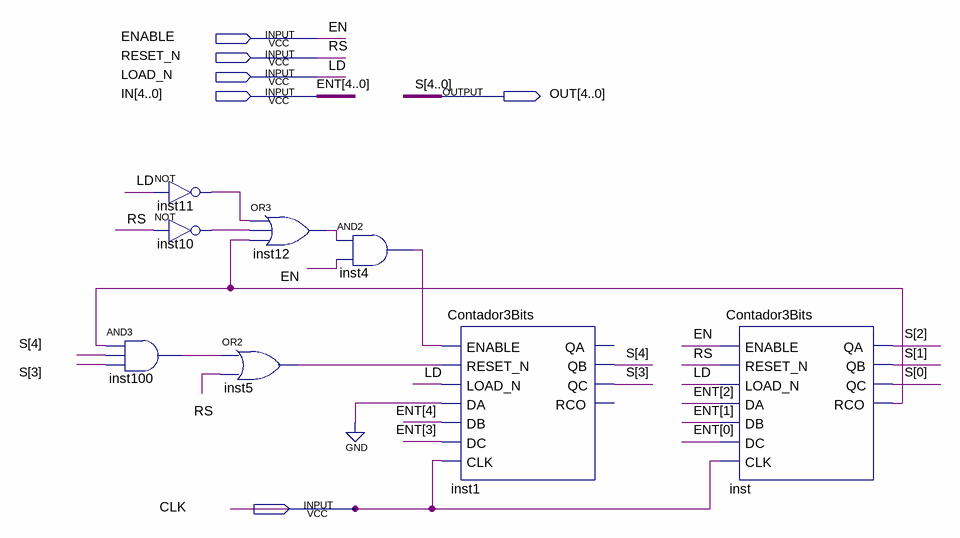
[diagram p0: schematic sheet]
// Quartus schematic PC.bdf as structural Verilog: 8 symbols, 6 pins
module PC (
  input  ENABLE,
  input  RESET_N,
  input  LOAD_N,
  input  [4:0] IN,
  input  CLK,
  output [4:0] OUT
);

  wire inst4_out, inst5_out, inst10_out, inst11_out, inst12_out, inst100_out, inst_rco;

  and inst100 (inst100_out, inst_rco, OUT[4], OUT[3]);
  not inst11 (inst11_out, LOAD_N);
  not inst10 (inst10_out, RESET_N);
  or inst12 (inst12_out, inst11_out, inst10_out, inst_rco);
  or inst5 (inst5_out, inst100_out, RESET_N);
  and inst4 (inst4_out, inst12_out, ENABLE);
  Contador3Bits inst1 (
    .ENABLE(inst4_out), .RESET_N(inst5_out), .LOAD_N(LOAD_N), .DA(1'b0), .DB(IN[4]), .DC(IN[3]), .CLK(CLK),
    .QB(OUT[4]), .QC(OUT[3]));  // open: QA, RCO
  Contador3Bits inst (
    .ENABLE(ENABLE), .RESET_N(RESET_N), .LOAD_N(LOAD_N), .DA(IN[2]), .DB(IN[1]), .DC(IN[0]), .CLK(CLK),
    .QA(OUT[2]), .QB(OUT[1]), .QC(OUT[0]), .RCO(inst_rco));

  // Other names for the same wires on the sheet: EN = ENABLE; ENT[4:0] = IN; LD = LOAD_N; RS = RESET_N; S[4:0] = OUT
endmodule
